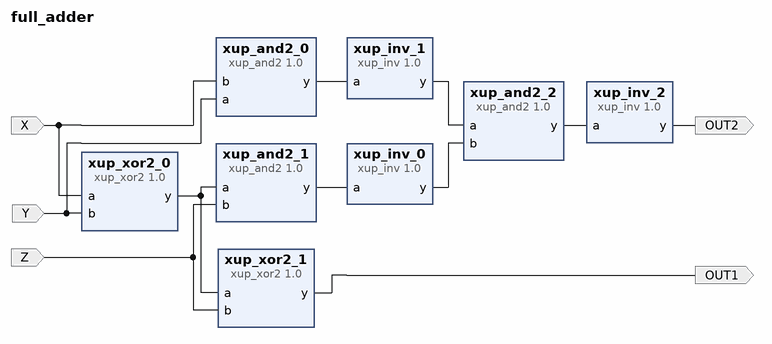
[diagram p0: block diagram of the top level]
# Vivado block design full_adder, xc7a35tcpg236-1, Vivado 2021.1
create_bd_design full_adder

create_bd_port -dir I Z
create_bd_port -dir I Y
create_bd_port -dir I X
create_bd_port -dir O OUT1
create_bd_port -dir O OUT2

create_bd_cell -type ip -vlnv xilinx.com:xup:xup_xor2:1.0 xup_xor2_0
create_bd_cell -type ip -vlnv xilinx.com:xup:xup_xor2:1.0 xup_xor2_1
create_bd_cell -type ip -vlnv xilinx.com:xup:xup_and2:1.0 xup_and2_0
create_bd_cell -type ip -vlnv xilinx.com:xup:xup_and2:1.0 xup_and2_1
create_bd_cell -type ip -vlnv xilinx.com:xup:xup_inv:1.0 xup_inv_0
create_bd_cell -type ip -vlnv xilinx.com:xup:xup_inv:1.0 xup_inv_1
create_bd_cell -type ip -vlnv xilinx.com:xup:xup_and2:1.0 xup_and2_2
create_bd_cell -type ip -vlnv xilinx.com:xup:xup_inv:1.0 xup_inv_2

# ---- connections ----

connect_bd_net [get_bd_ports X] [get_bd_pins xup_and2_0/b] [get_bd_pins xup_xor2_0/a]
connect_bd_net [get_bd_ports Y] [get_bd_pins xup_and2_0/a] [get_bd_pins xup_xor2_0/b]
connect_bd_net [get_bd_ports Z] [get_bd_pins xup_and2_1/b] [get_bd_pins xup_xor2_1/b]
connect_bd_net [get_bd_pins xup_and2_0/y] [get_bd_pins xup_inv_1/a]
connect_bd_net [get_bd_pins xup_and2_1/y] [get_bd_pins xup_inv_0/a]
connect_bd_net [get_bd_pins xup_and2_2/y] [get_bd_pins xup_inv_2/a]
connect_bd_net [get_bd_pins xup_inv_0/y] [get_bd_pins xup_and2_2/b]
connect_bd_net [get_bd_pins xup_inv_1/y] [get_bd_pins xup_and2_2/a]
connect_bd_net [get_bd_pins xup_inv_2/y] [get_bd_ports OUT2]
connect_bd_net [get_bd_pins xup_xor2_0/y] [get_bd_pins xup_xor2_1/a] [get_bd_pins xup_and2_1/a]
connect_bd_net [get_bd_pins xup_xor2_1/y] [get_bd_ports OUT1]

validate_bd_design
save_bd_design
